# Altium project Swarm-Medusa-Antenna.PrjPcb
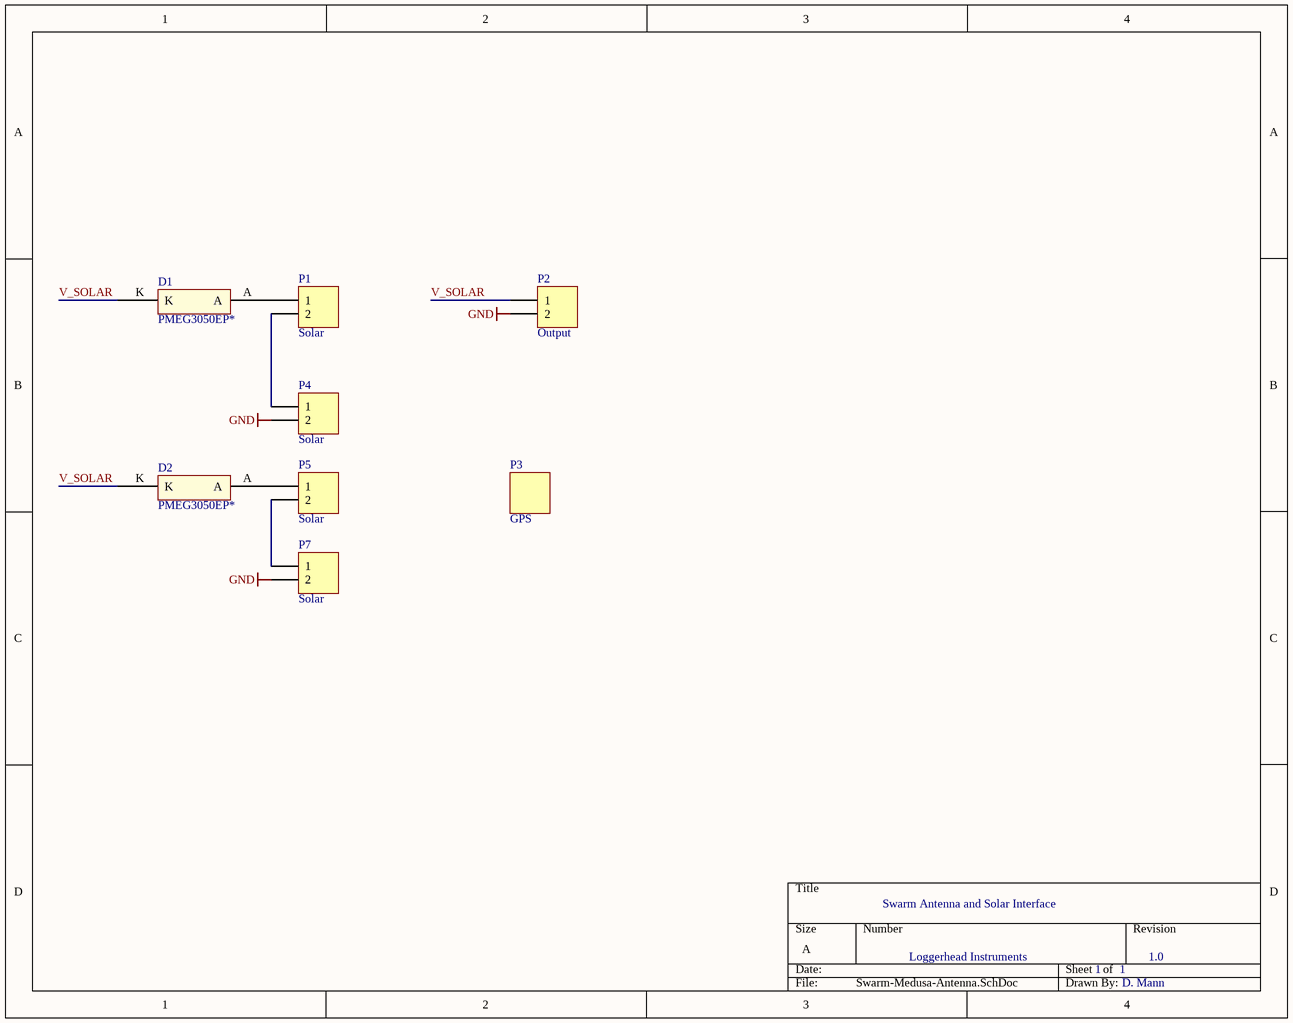
[diagram p0: Swarm-Medusa-Antenna.SchDoc]
1 sheet, 8 parts. Net scope: global (net labels, ports and power ports of the same name join across sheets).
Board file: Swarm-Medusa-Antenna.PcbDoc

## Sheet Swarm-Medusa-Antenna.SchDoc
size A; SheetNumber: 1; SheetTotal: 1

### Parts
D1  PMEG3050EP*  [Diode_PMEG3050EP]
D2  PMEG3050EP*  [Diode_PMEG3050EP]
P1  Solar  [HDR1X2]
P2  Output  [HDR1X2]
P3  GPS  [Iridium Antenna]
P4  Solar  [HDR1X2]
P5  Solar  [HDR1X2]
P7  Solar  [HDR1X2]

### Nets
GND: P2.2 P4.2 P7.2
V_SOLAR: D1.K D2.K P2.1
NetD1_A: D1.A P1.1
NetD2_A: D2.A P5.1
NetP1_2: P1.2 P4.1
NetP5_2: P5.2 P7.1

### Notes on the sheet
- Swarm Antenna and Solar Interface
- Loggerhead Instruments
- 1
- 1.0
- D. Mann

### Library data of the parts
D1 D2 = Diode_PMEG3050EP
P1 P2 P4 P5 P7 = Header 2: Header, 2-Pin; LatestRevisionDate: 17-Jul-2002; LatestRevisionNote: Re-released for DXP Platform.; Publisher: Altium Limited
P3 = Iridium Antenna